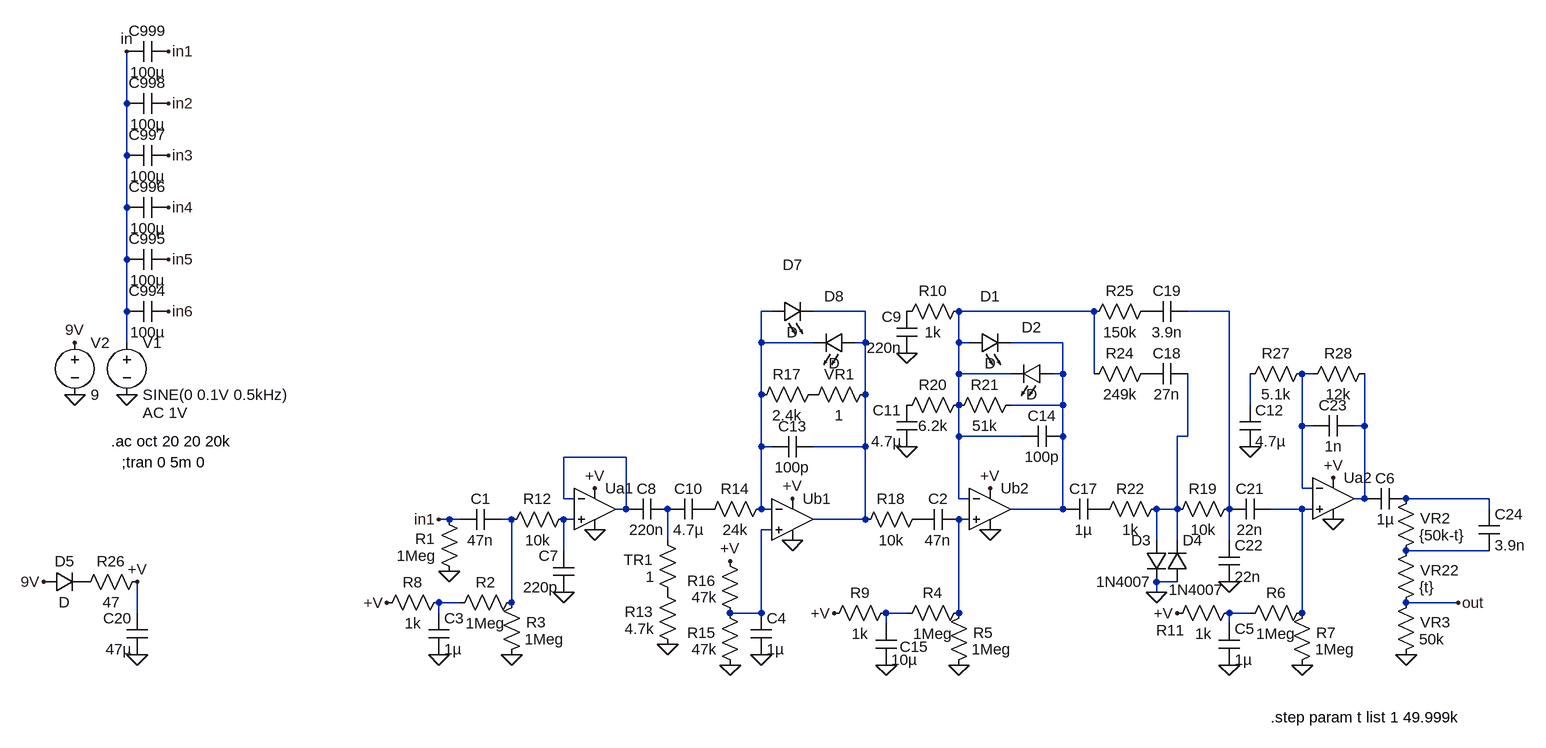
[diagram p0: schematic LingonberryOD.asc]
LingonberryOD.asc, the LTspice schematic file:
Version 4
SHEET 1 3408 3732
WIRE -1568 704 -1568 624
WIRE -1568 784 -1568 704
WIRE -1568 864 -1568 784
WIRE -1568 944 -1568 864
WIRE -1568 1024 -1568 944
WIRE -576 1024 -592 1024
WIRE -432 1024 -512 1024
WIRE -80 1024 -288 1024
WIRE 128 1024 64 1024
WIRE -1568 1072 -1568 1024
WIRE -592 1072 -592 1024
WIRE -512 1072 -592 1072
WIRE -432 1072 -432 1024
WIRE -432 1072 -448 1072
WIRE -288 1072 -288 1024
WIRE -272 1072 -288 1072
WIRE -128 1072 -208 1072
WIRE -288 1120 -288 1072
WIRE -208 1120 -288 1120
WIRE -128 1120 -128 1072
WIRE -128 1120 -144 1120
WIRE -80 1120 -80 1024
WIRE 256 1120 240 1120
WIRE -592 1152 -592 1072
WIRE -432 1152 -432 1072
WIRE -288 1168 -288 1120
WIRE -128 1168 -128 1120
WIRE -128 1168 -208 1168
WIRE 160 1168 160 1120
WIRE 240 1200 240 1120
WIRE 256 1200 240 1200
WIRE 336 1200 336 1120
WIRE 336 1200 320 1200
WIRE -288 1216 -288 1168
WIRE -192 1216 -288 1216
WIRE -128 1216 -128 1168
WIRE 64 1216 64 1120
WIRE 64 1216 48 1216
WIRE -592 1232 -592 1152
WIRE -576 1232 -592 1232
WIRE -432 1232 -432 1152
WIRE -432 1232 -512 1232
WIRE -800 1248 -896 1248
WIRE 240 1296 240 1200
WIRE 256 1296 240 1296
WIRE -896 1312 -896 1248
WIRE -880 1312 -896 1312
WIRE -288 1312 -288 1216
WIRE -272 1312 -288 1312
WIRE 336 1312 336 1200
WIRE 336 1312 320 1312
WIRE 528 1312 400 1312
WIRE -800 1328 -800 1248
WIRE -800 1328 -816 1328
WIRE -592 1328 -592 1232
WIRE -576 1328 -592 1328
WIRE -128 1328 -128 1216
WIRE -128 1328 -208 1328
WIRE 48 1328 48 1216
WIRE 48 1328 16 1328
WIRE 128 1328 128 1024
WIRE 240 1328 192 1328
WIRE 256 1328 240 1328
WIRE 528 1328 528 1312
WIRE -1072 1344 -1088 1344
WIRE -1056 1344 -1072 1344
WIRE -976 1344 -992 1344
WIRE -880 1344 -896 1344
WIRE -432 1344 -432 1232
WIRE -432 1344 -512 1344
WIRE -272 1344 -288 1344
WIRE -576 1360 -592 1360
WIRE -736 1376 -736 1328
WIRE 16 1376 16 1328
WIRE 48 1376 48 1328
WIRE 128 1376 128 1328
WIRE -896 1392 -896 1344
WIRE 528 1392 400 1392
WIRE 48 1440 16 1440
WIRE 16 1456 16 1440
WIRE -1056 1472 -1088 1472
WIRE -976 1472 -976 1344
WIRE 480 1472 400 1472
WIRE -1552 1488 -1552 1440
WIRE -1088 1488 -1088 1472
WIRE -592 1488 -592 1360
WIRE -592 1488 -640 1488
WIRE -368 1488 -400 1488
WIRE -288 1488 -288 1344
WIRE 160 1488 128 1488
WIRE 240 1488 240 1328
WIRE -400 1504 -400 1488
WIRE 128 1504 128 1488
FLAG -1568 1152 0
FLAG -1568 624 in
FLAG -1648 1152 0
FLAG -1648 1072 9V
FLAG -1504 624 in1
FLAG -1504 704 in2
FLAG -1504 784 in3
FLAG -1504 864 in4
FLAG -1504 944 in5
FLAG -1504 1024 in6
FLAG -1088 1344 in1
FLAG -1696 1440 9V
FLAG -1552 1552 0
FLAG -1552 1440 +V
FLAG -1168 1472 +V
FLAG -976 1552 0
FLAG -1088 1552 0
FLAG -1072 1424 0
FLAG -848 1296 +V
FLAG -848 1360 0
FLAG -896 1456 0
FLAG -736 1536 0
FLAG -640 1568 0
FLAG -640 1408 +V
FLAG -592 1552 0
FLAG -544 1312 +V
FLAG -544 1376 0
FLAG -240 1296 +V
FLAG -240 1360 0
FLAG -480 1488 +V
FLAG -288 1568 0
FLAG -400 1568 0
FLAG 16 1456 0
FLAG 128 1440 0
FLAG 48 1488 +V
FLAG 240 1568 0
FLAG 128 1568 0
FLAG 288 1280 +V
FLAG 288 1344 0
FLAG -368 1232 0
FLAG -368 1088 0
FLAG 160 1232 0
FLAG 400 1552 0
FLAG 480 1472 out
SYMBOL voltage -1568 1056 R0
WINDOW 123 24 124 Left 2
WINDOW 39 0 0 Left 2
SYMATTR Value2 AC 1V
SYMATTR InstName V1
SYMATTR Value SINE(0 0.1V 0.5kHz)
SYMBOL voltage -1648 1056 R0
WINDOW 123 0 0 Left 0
WINDOW 39 0 0 Left 0
SYMATTR InstName V2
SYMATTR Value 9
SYMBOL cap -1504 688 R90
WINDOW 0 0 32 VBottom 2
WINDOW 3 32 32 VTop 2
SYMATTR InstName C998
SYMATTR Value 100µ
SYMBOL cap -1504 768 R90
WINDOW 0 0 32 VBottom 2
WINDOW 3 32 32 VTop 2
SYMATTR InstName C997
SYMATTR Value 100µ
SYMBOL cap -1504 848 R90
WINDOW 0 0 32 VBottom 2
WINDOW 3 32 32 VTop 2
SYMATTR InstName C996
SYMATTR Value 100µ
SYMBOL cap -1504 608 R90
WINDOW 0 0 32 VBottom 2
WINDOW 3 32 32 VTop 2
SYMATTR InstName C999
SYMATTR Value 100µ
SYMBOL cap -1504 928 R90
WINDOW 0 0 32 VBottom 2
WINDOW 3 32 32 VTop 2
SYMATTR InstName C995
SYMATTR Value 100µ
SYMBOL cap -1504 1008 R90
WINDOW 0 0 32 VBottom 2
WINDOW 3 32 32 VTop 2
SYMATTR InstName C994
SYMATTR Value 100µ
SYMBOL cap -880 1456 R180
WINDOW 0 24 56 Left 2
WINDOW 3 24 8 Left 2
SYMATTR InstName C7
SYMATTR Value 220p
SYMBOL diode -1696 1456 R270
WINDOW 0 32 32 VTop 2
WINDOW 3 0 32 VBottom 2
SYMATTR InstName D5
SYMBOL res -1536 1424 R90
WINDOW 0 0 56 VBottom 2
WINDOW 3 32 56 VTop 2
SYMATTR InstName R26
SYMATTR Value 47
SYMBOL cap -1536 1552 R180
WINDOW 0 24 56 Left 2
WINDOW 3 24 8 Left 2
SYMATTR InstName C20
SYMATTR Value 47µ
SYMBOL res -1056 1440 R180
WINDOW 0 38 66 Left 2
WINDOW 3 36 40 Left 2
SYMATTR InstName R1
SYMATTR Value 1Meg
SYMBOL cap -992 1328 R90
WINDOW 0 0 32 VBottom 2
WINDOW 3 32 32 VTop 2
SYMATTR InstName C1
SYMATTR Value 47n
SYMBOL res -1072 1456 R90
WINDOW 0 0 56 VBottom 2
WINDOW 3 32 56 VTop 2
SYMATTR InstName R8
SYMATTR Value 1k
SYMBOL cap -1104 1552 M180
WINDOW 0 24 56 Left 2
WINDOW 3 24 8 Left 2
SYMATTR InstName C3
SYMATTR Value 1µ
SYMBOL res -992 1568 M180
WINDOW 0 38 66 Left 2
WINDOW 3 36 40 Left 2
SYMATTR InstName R3
SYMATTR Value 1Meg
SYMBOL Opamps\\UniversalOpamp2 -848 1328 R0
SYMATTR InstName Ua1
SYMBOL res -880 1328 R90
WINDOW 0 0 56 VBottom 2
WINDOW 3 32 56 VTop 2
SYMATTR InstName R12
SYMATTR Value 10k
SYMBOL cap -736 1312 R90
WINDOW 0 0 32 VBottom 2
WINDOW 3 32 32 VTop 2
SYMATTR InstName C8
SYMATTR Value 220n
SYMBOL res -720 1472 R180
WINDOW 0 38 66 Left 2
WINDOW 3 36 40 Left 2
SYMATTR InstName TR1
SYMATTR Value 1
SYMBOL res -720 1552 R180
WINDOW 0 38 66 Left 2
WINDOW 3 36 40 Left 2
SYMATTR InstName R13
SYMATTR Value 4.7k
SYMBOL cap -672 1312 R90
WINDOW 0 0 32 VBottom 2
WINDOW 3 32 32 VTop 2
SYMATTR InstName C10
SYMATTR Value 4.7µ
SYMBOL res -576 1312 R90
WINDOW 0 0 56 VBottom 2
WINDOW 3 32 56 VTop 2
SYMATTR InstName R14
SYMATTR Value 24k
SYMBOL res -624 1504 R180
WINDOW 0 38 66 Left 2
WINDOW 3 36 40 Left 2
SYMATTR InstName R16
SYMATTR Value 47k
SYMBOL res -624 1584 R180
WINDOW 0 38 66 Left 2
WINDOW 3 36 40 Left 2
SYMATTR InstName R15
SYMATTR Value 47k
SYMBOL cap -608 1552 M180
WINDOW 0 24 56 Left 2
WINDOW 3 24 8 Left 2
SYMATTR InstName C4
SYMATTR Value 1µ
SYMBOL Opamps\\UniversalOpamp2 -544 1344 R0
SYMATTR InstName Ub1
SYMBOL cap -512 1216 R90
WINDOW 0 0 32 VBottom 2
WINDOW 3 32 32 VTop 2
SYMATTR InstName C13
SYMATTR Value 100p
SYMBOL res -496 1136 R90
WINDOW 0 0 56 VBottom 2
WINDOW 3 32 56 VTop 2
SYMATTR InstName R17
SYMATTR Value 2.4k
SYMBOL res -416 1136 R90
WINDOW 0 0 56 VBottom 2
WINDOW 3 32 56 VTop 2
SYMATTR InstName VR1
SYMATTR Value 1
SYMBOL LED -576 1040 R270
WINDOW 0 72 32 VTop 2
WINDOW 3 0 32 VBottom 2
SYMATTR InstName D7
SYMBOL LED -448 1088 M270
WINDOW 0 72 32 VTop 2
WINDOW 3 0 32 VBottom 2
SYMATTR InstName D8
SYMBOL res -336 1328 R90
WINDOW 0 0 56 VBottom 2
WINDOW 3 32 56 VTop 2
SYMATTR InstName R18
SYMATTR Value 10k
SYMBOL cap -288 1328 R90
WINDOW 0 0 32 VBottom 2
WINDOW 3 32 32 VTop 2
SYMATTR InstName C2
SYMATTR Value 47n
SYMBOL Opamps\\UniversalOpamp2 -240 1328 R0
SYMATTR InstName Ub2
SYMBOL res -960 1456 R90
WINDOW 0 0 56 VBottom 2
WINDOW 3 32 56 VTop 2
SYMATTR InstName R2
SYMATTR Value 1Meg
SYMBOL res -384 1472 R90
WINDOW 0 0 56 VBottom 2
WINDOW 3 32 56 VTop 2
SYMATTR InstName R9
SYMATTR Value 1k
SYMBOL cap -416 1568 M180
WINDOW 0 37 28 Left 2
WINDOW 3 24 8 Left 2
SYMATTR InstName C15
SYMATTR Value 10µ
SYMBOL res -304 1584 M180
WINDOW 0 38 66 Left 2
WINDOW 3 36 40 Left 2
SYMATTR InstName R5
SYMATTR Value 1Meg
SYMBOL res -272 1472 R90
WINDOW 0 0 56 VBottom 2
WINDOW 3 32 56 VTop 2
SYMATTR InstName R4
SYMATTR Value 1Meg
SYMBOL cap -128 1200 R90
WINDOW 0 0 32 VBottom 2
WINDOW 3 32 32 VTop 2
SYMATTR InstName C14
SYMATTR Value 100p
SYMBOL res -192 1152 R90
WINDOW 0 0 56 VBottom 2
WINDOW 3 32 56 VTop 2
SYMATTR InstName R21
SYMATTR Value 51k
SYMBOL LED -144 1136 M270
WINDOW 0 72 32 VTop 2
WINDOW 3 0 32 VBottom 2
SYMATTR InstName D2
SYMBOL LED -272 1088 R270
WINDOW 0 72 32 VTop 2
WINDOW 3 0 32 VBottom 2
SYMATTR InstName D1
SYMBOL cap -64 1312 R90
WINDOW 0 0 32 VBottom 2
WINDOW 3 32 32 VTop 2
SYMATTR InstName C17
SYMATTR Value 1µ
SYMBOL res 32 1312 R90
WINDOW 0 0 56 VBottom 2
WINDOW 3 32 56 VTop 2
SYMATTR InstName R22
SYMATTR Value 1k
SYMBOL diode 32 1376 M0
SYMATTR InstName D3
SYMATTR Value 1N4007
SYMBOL diode 32 1440 M180
WINDOW 0 24 64 Left 2
WINDOW 3 3 -12 Left 2
SYMATTR InstName D4
SYMATTR Value 1N4007
SYMBOL res 144 1312 R90
WINDOW 0 0 56 VBottom 2
WINDOW 3 32 56 VTop 2
SYMATTR InstName R19
SYMATTR Value 10k
SYMBOL res 16 1104 R90
WINDOW 0 0 56 VBottom 2
WINDOW 3 32 56 VTop 2
SYMATTR InstName R24
SYMATTR Value 249k
SYMBOL cap 64 1104 R90
WINDOW 0 0 32 VBottom 2
WINDOW 3 32 32 VTop 2
SYMATTR InstName C18
SYMATTR Value 27n
SYMBOL res 16 1008 R90
WINDOW 0 0 56 VBottom 2
WINDOW 3 32 56 VTop 2
SYMATTR InstName R25
SYMATTR Value 150k
SYMBOL cap 64 1008 R90
WINDOW 0 0 32 VBottom 2
WINDOW 3 32 32 VTop 2
SYMATTR InstName C19
SYMATTR Value 3.9n
SYMBOL cap 112 1440 M180
WINDOW 0 24 56 Left 2
WINDOW 3 24 8 Left 2
SYMATTR InstName C22
SYMATTR Value 22n
SYMBOL cap 192 1312 R90
WINDOW 0 0 32 VBottom 2
WINDOW 3 32 32 VTop 2
SYMATTR InstName C21
SYMATTR Value 22n
SYMBOL res 144 1472 R90
WINDOW 0 58 106 VBottom 2
WINDOW 3 32 56 VTop 2
SYMATTR InstName R11
SYMATTR Value 1k
SYMBOL cap 112 1568 M180
WINDOW 0 24 56 Left 2
WINDOW 3 24 8 Left 2
SYMATTR InstName C5
SYMATTR Value 1µ
SYMBOL res 224 1584 M180
WINDOW 0 38 66 Left 2
WINDOW 3 36 40 Left 2
SYMATTR InstName R7
SYMATTR Value 1Meg
SYMBOL res 256 1472 R90
WINDOW 0 0 56 VBottom 2
WINDOW 3 32 56 VTop 2
SYMATTR InstName R6
SYMATTR Value 1Meg
SYMBOL Opamps\\UniversalOpamp2 288 1312 R0
SYMATTR InstName Ua2
SYMBOL cap 320 1184 R90
WINDOW 0 0 32 VBottom 2
WINDOW 3 32 32 VTop 2
SYMATTR InstName C23
SYMATTR Value 1n
SYMBOL res 352 1104 R90
WINDOW 0 0 56 VBottom 2
WINDOW 3 32 56 VTop 2
SYMATTR InstName R28
SYMATTR Value 12k
SYMBOL res -272 1008 R90
WINDOW 0 0 56 VBottom 2
WINDOW 3 32 56 VTop 2
SYMATTR InstName R10
SYMATTR Value 1k
SYMBOL res -272 1152 R90
WINDOW 0 0 56 VBottom 2
WINDOW 3 32 56 VTop 2
SYMATTR InstName R20
SYMATTR Value 6.2k
SYMBOL cap -352 1088 R180
WINDOW 0 24 56 Left 2
WINDOW 3 24 8 Left 2
SYMATTR InstName C9
SYMATTR Value 220n
SYMBOL cap -352 1232 R180
WINDOW 0 24 56 Left 2
WINDOW 3 24 8 Left 2
SYMATTR InstName C11
SYMATTR Value 4.7µ
SYMBOL res 256 1104 R90
WINDOW 0 0 56 VBottom 2
WINDOW 3 32 56 VTop 2
SYMATTR InstName R27
SYMATTR Value 5.1k
SYMBOL cap 144 1232 M180
WINDOW 0 24 56 Left 2
WINDOW 3 24 8 Left 2
SYMATTR InstName C12
SYMATTR Value 4.7µ
SYMBOL cap 400 1296 R90
WINDOW 0 0 32 VBottom 2
WINDOW 3 32 32 VTop 2
SYMATTR InstName C6
SYMATTR Value 1µ
SYMBOL res 384 1408 M180
WINDOW 0 38 66 Left 2
WINDOW 3 36 40 Left 2
SYMATTR InstName VR2
SYMATTR Value {50k-t}
SYMBOL res 384 1488 M180
WINDOW 0 38 66 Left 2
WINDOW 3 36 40 Left 2
SYMATTR InstName VR22
SYMATTR Value {t}
SYMBOL res 384 1568 M180
WINDOW 0 38 66 Left 2
WINDOW 3 36 40 Left 2
SYMATTR InstName VR3
SYMATTR Value 50k
SYMBOL cap 512 1392 M180
WINDOW 0 24 56 Left 2
WINDOW 3 24 8 Left 2
SYMATTR InstName C24
SYMATTR Value 3.9n
TEXT -1592 1224 Left 2 !.ac oct 20 20 20k
TEXT -1576 1256 Left 2 !;tran 0 5m 0
TEXT 192 1648 Left 2 !.step param t list 1 49.999k

The netlist it stands for:
* LingonberryOD.asc
V1 in 0 SINE(0 0.1V 0.5kHz) AC 1V
V2 9V 0 9
C998 in2 in 100µ
C997 in3 in 100µ
C996 in4 in 100µ
C999 in1 in 100µ
C995 in5 in 100µ
C994 in6 in 100µ
C7 0 N014 220p
D5 9V P001 D
R26 +V P001 47
C20 0 +V 47µ
R1 0 in1 1Meg
C1 N013 in1 47n
R8 N019 +V 1k
C3 0 N019 1µ
R3 0 N013 1Meg
XUa1 N014 N010 +V 0 N010 level.2 Avol=1Meg GBW=10Meg Slew=10Meg ilimit=25m rail=0 Vos=0 phimargin=45 en=0 enk=0 in=0 ink=0 Rin=500Meg  ; pins IN+ IN- V+ V- OUT
R12 N014 N013 10k
C8 N017 N010 220n
R§TR1 P002 N017 1
R13 0 P002 4.7k
C10 P003 N017 4.7µ
R14 N001 P003 24k
R16 N016 +V 47k
R15 0 N016 47k
C4 0 N016 1µ
XUb1 N016 N001 +V 0 N002 level.2 Avol=1Meg GBW=10Meg Slew=10Meg ilimit=25m rail=0 Vos=0 phimargin=45 en=0 enk=0 in=0 ink=0 Rin=500Meg  ; pins IN+ IN- V+ V- OUT
C13 N002 N001 100p
R17 P004 N001 2.4k
R§VR1 N002 P004 1
D7 N001 N002 D
D8 N002 N001 D
R18 P005 N002 10k
C2 N015 P005 47n
XUb2 N015 N003 +V 0 N005 level.2 Avol=1Meg GBW=10Meg Slew=10Meg ilimit=25m rail=0 Vos=0 phimargin=45 en=0 enk=0 in=0 ink=0 Rin=500Meg  ; pins IN+ IN- V+ V- OUT
R2 N013 N019 1Meg
R9 N020 +V 1k
C15 0 N020 10µ
R5 0 N015 1Meg
R4 N015 N020 1Meg
C14 N005 N003 100p
R21 N005 N003 51k
D2 N005 N003 D
D1 N003 N005 D
C17 P006 N005 1µ
R22 N009 P006 1k
D3 N009 0 1N4007
D4 0 N009 1N4007
R19 N004 N009 10k
R24 P007 N003 249k
C18 N009 P007 27n
R25 P008 N003 150k
C19 N004 P008 3.9n
C22 0 N004 22n
C21 N012 N004 22n
R11 N021 +V 1k
C5 0 N021 1µ
R7 0 N012 1Meg
R6 N012 N021 1Meg
XUa2 N012 N006 +V 0 N008 level.2 Avol=1Meg GBW=10Meg Slew=10Meg ilimit=25m rail=0 Vos=0 phimargin=45 en=0 enk=0 in=0 ink=0 Rin=500Meg  ; pins IN+ IN- V+ V- OUT
C23 N008 N006 1n
R28 N008 N006 12k
R10 N003 P009 1k
R20 N003 P010 6.2k
C9 0 P009 220n
C11 0 P010 4.7µ
R27 N006 N007 5.1k
C12 0 N007 4.7µ
C6 N011 N008 1µ
R§VR2 N018 N011 {50k-t}
R§VR22 out N018 {t}
R§VR3 0 out 50k
C24 N018 N011 3.9n
.model D D
.lib standard.dio
.ac oct 20 20 20k
;tran 0 5m 0
.step param t list 1 49.999k
.lib UniversalOpamps2.sub
.backanno
.end